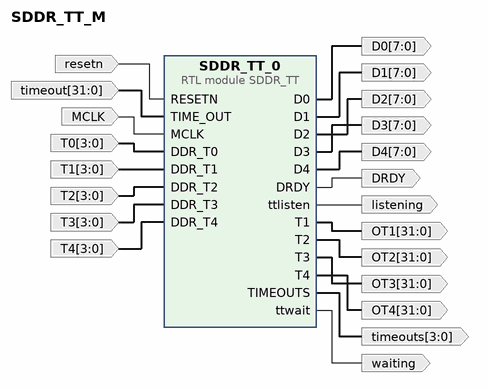
[diagram p0: block diagram of the top level]
# Vivado block design SDDR_TT_M, xc7z020clg400-1, Vivado 2019.1
create_bd_design SDDR_TT_M

create_bd_port -dir O -from 7 -to 0 D0
create_bd_port -dir O -from 7 -to 0 D1
create_bd_port -dir O -from 7 -to 0 D2
create_bd_port -dir O -from 7 -to 0 D3
create_bd_port -dir O -from 7 -to 0 D4
create_bd_port -dir O DRDY
create_bd_port -dir O -from 31 -to 0 OT1
create_bd_port -dir O -from 31 -to 0 OT2
create_bd_port -dir O -from 31 -to 0 OT3
create_bd_port -dir O -from 31 -to 0 OT4
create_bd_port -dir O listening
create_bd_port -dir I -type rst resetn
create_bd_port -dir I -from 31 -to 0 timeout
create_bd_port -dir O -from 3 -to 0 timeouts
create_bd_port -dir O waiting
create_bd_port -dir I MCLK
create_bd_port -dir I -from 3 -to 0 -type data T0
create_bd_port -dir I -from 3 -to 0 -type data T1
create_bd_port -dir I -from 3 -to 0 -type data T2
create_bd_port -dir I -from 3 -to 0 -type data T3
create_bd_port -dir I -from 3 -to 0 -type data T4

create_bd_cell -type module -reference SDDR_TT SDDR_TT_0

# ---- connections ----

connect_bd_net [get_bd_pins SDDR_TT_0/D0] [get_bd_ports D0]
connect_bd_net [get_bd_pins SDDR_TT_0/D1] [get_bd_ports D1]
connect_bd_net [get_bd_pins SDDR_TT_0/D2] [get_bd_ports D2]
connect_bd_net [get_bd_pins SDDR_TT_0/D3] [get_bd_ports D3]
connect_bd_net [get_bd_pins SDDR_TT_0/D4] [get_bd_ports D4]
connect_bd_net [get_bd_pins SDDR_TT_0/DRDY] [get_bd_ports DRDY]
connect_bd_net [get_bd_pins SDDR_TT_0/T1] [get_bd_ports OT1]
connect_bd_net [get_bd_pins SDDR_TT_0/T2] [get_bd_ports OT2]
connect_bd_net [get_bd_pins SDDR_TT_0/T3] [get_bd_ports OT3]
connect_bd_net [get_bd_pins SDDR_TT_0/T4] [get_bd_ports OT4]
connect_bd_net [get_bd_pins SDDR_TT_0/TIMEOUTS] [get_bd_ports timeouts]
connect_bd_net [get_bd_pins SDDR_TT_0/ttlisten] [get_bd_ports listening]
connect_bd_net [get_bd_pins SDDR_TT_0/ttwait] [get_bd_ports waiting]
connect_bd_net [get_bd_ports resetn] [get_bd_pins SDDR_TT_0/RESETN]
connect_bd_net [get_bd_ports timeout] [get_bd_pins SDDR_TT_0/TIME_OUT]
connect_bd_net [get_bd_ports MCLK] [get_bd_pins SDDR_TT_0/MCLK]
connect_bd_net -net T0_1 [get_bd_ports T0] [get_bd_pins SDDR_TT_0/DDR_T0]
connect_bd_net -net T1_1 [get_bd_ports T1] [get_bd_pins SDDR_TT_0/DDR_T1]
connect_bd_net -net T2_1 [get_bd_ports T2] [get_bd_pins SDDR_TT_0/DDR_T2]
connect_bd_net -net T3_1 [get_bd_ports T3] [get_bd_pins SDDR_TT_0/DDR_T3]
connect_bd_net -net T4_1 [get_bd_ports T4] [get_bd_pins SDDR_TT_0/DDR_T4]

validate_bd_design
save_bd_design
